# EAGLE schematic Tiny Programmer_PT (EAGLE 6.1)
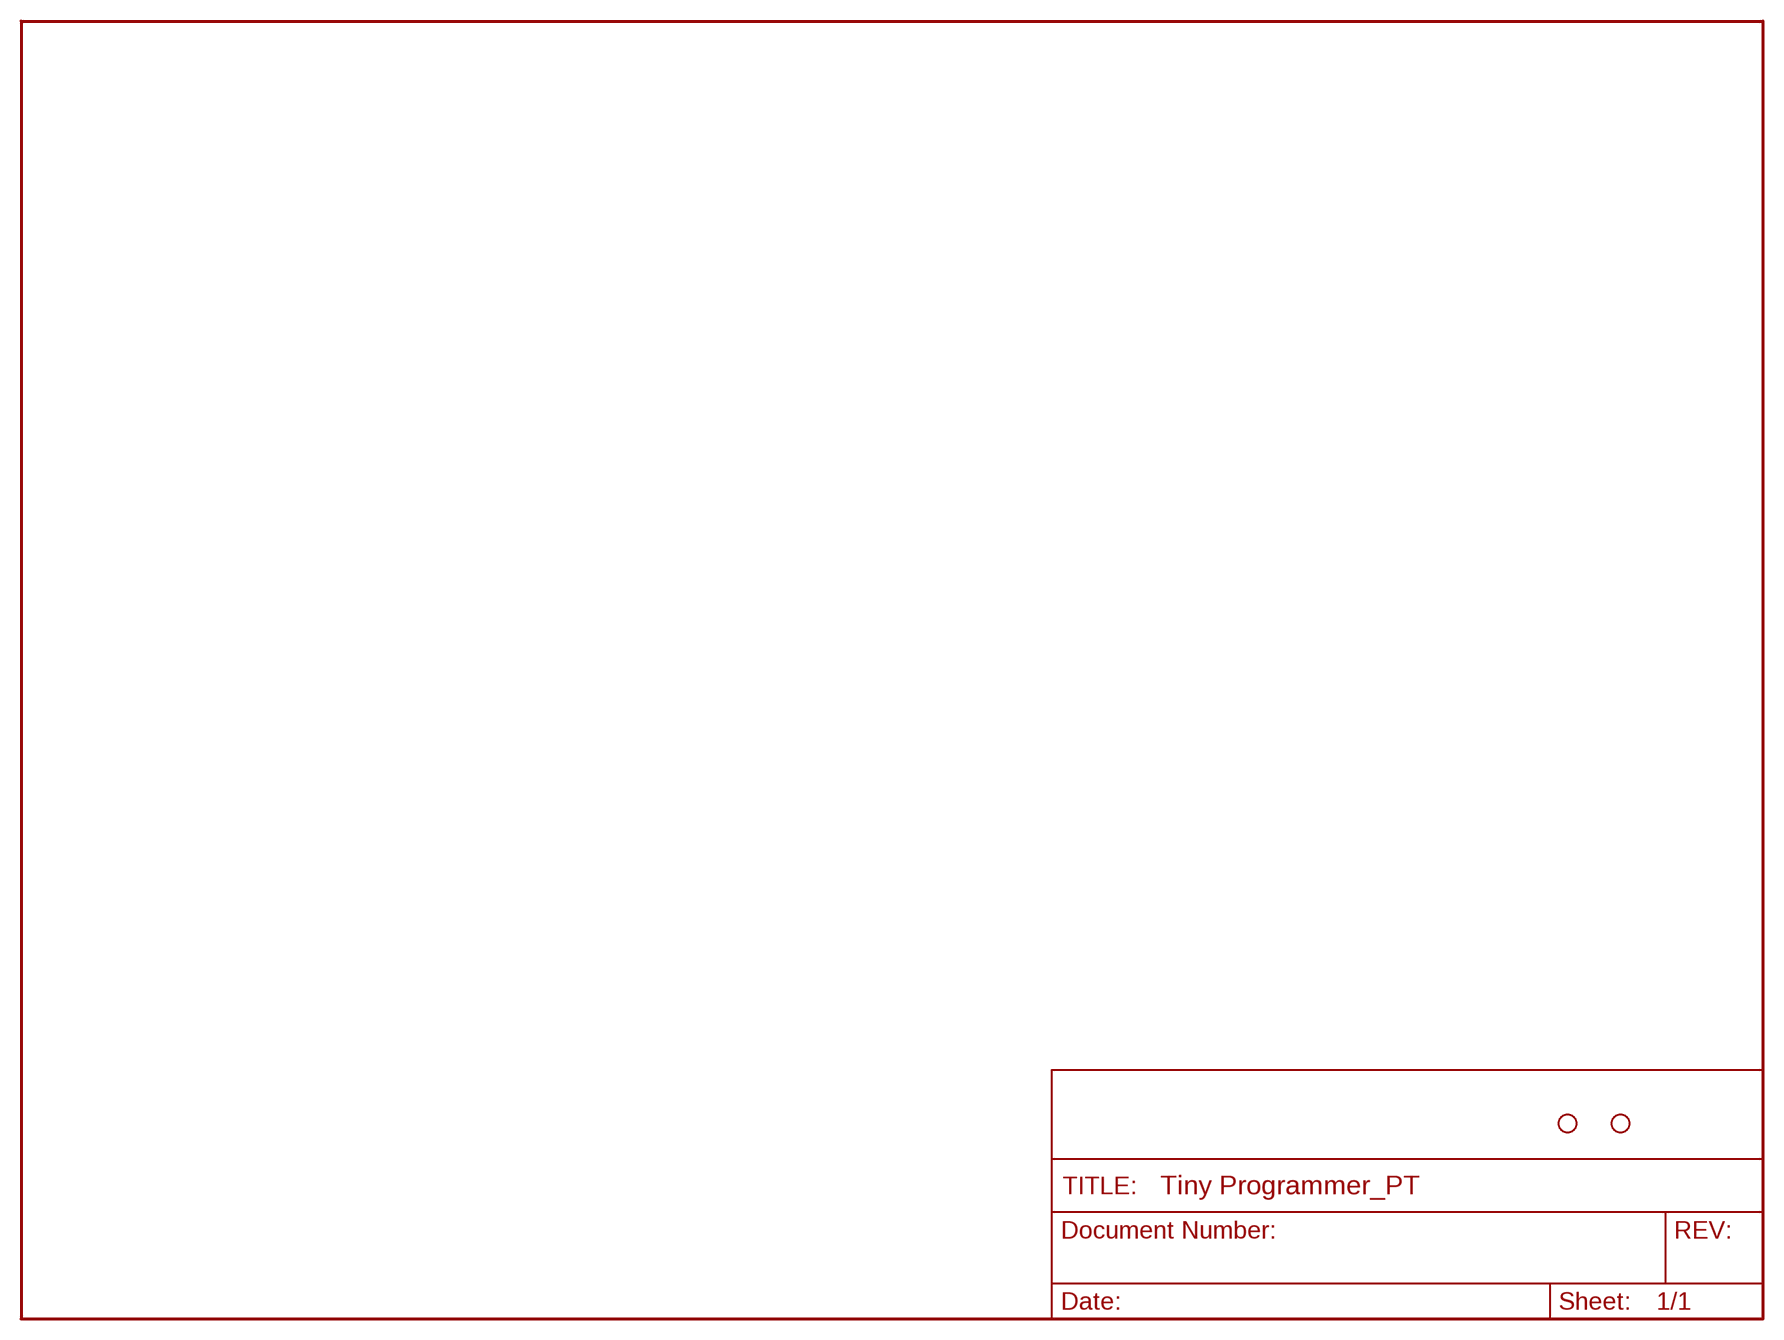
[diagram p0: schematic, sheet 1]

## Parts
JP8  STAND-OFFTIGHTER  [STAND-OFF-TIGHTER]
JP9  STAND-OFFTIGHTER  [STAND-OFF-TIGHTER]

## Library data of the parts
JP8 JP9 = Testing:STAND-OFF: Stand Off This is the mechanical footprint for a #4 phillips button head screw. Use the keepout ring to avoid running the screw head into surrounding components. SKU : PRT-00447

## Net classes
1 BIG: width 0.762 mm, clearance 0.305 mm to class 0, clearance 0.305 mm